# EAGLE design Qwiic Featherwing (EAGLE 8.5.0)
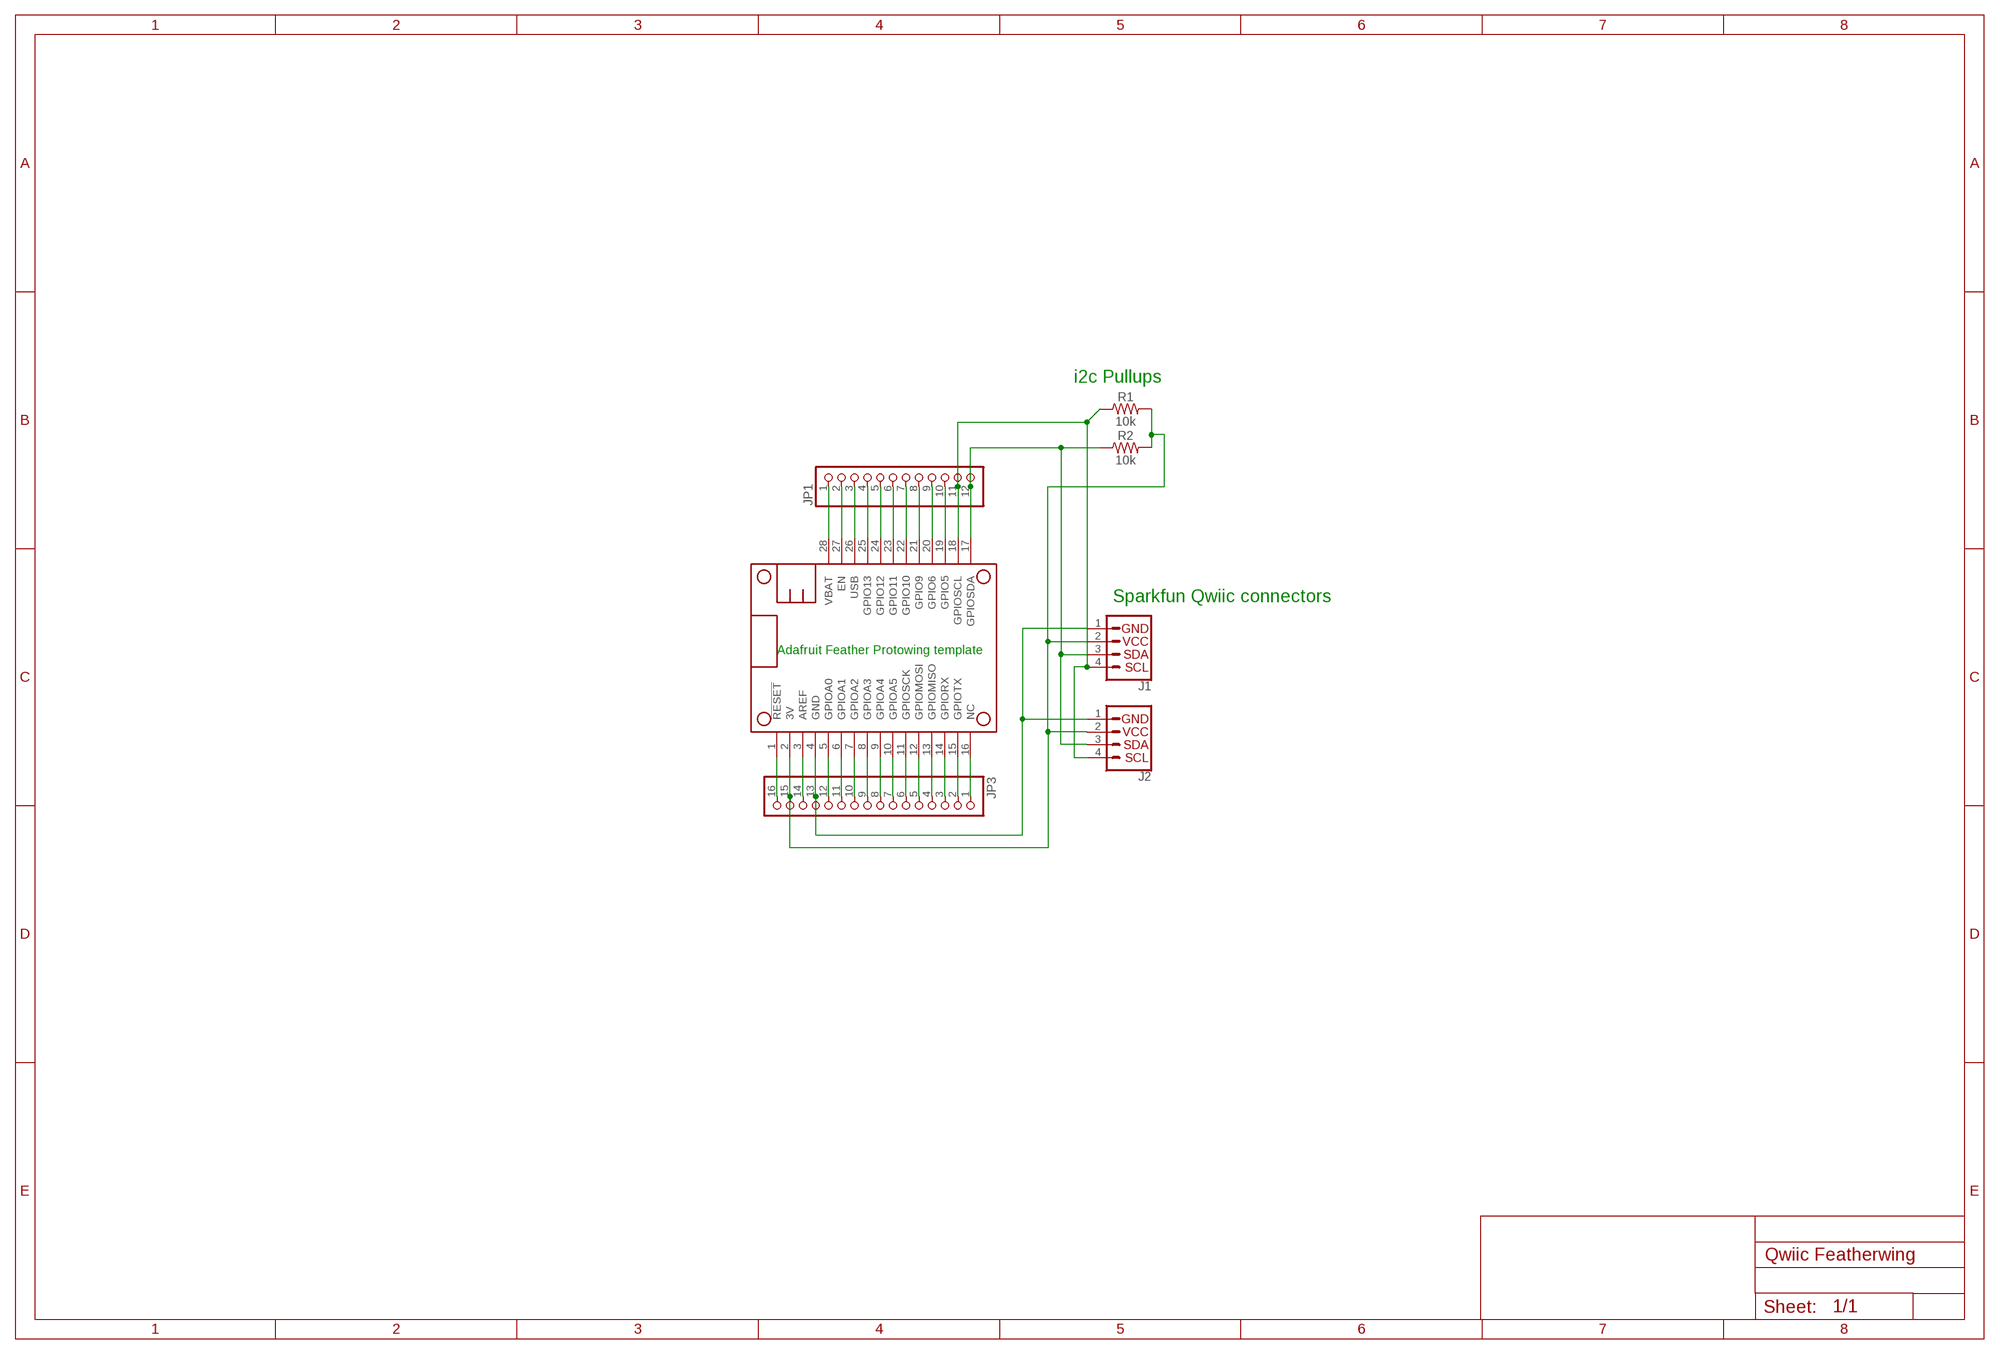
[diagram p0: schematic, sheet 1]

## Parts
J1  QWIIC_CONNECTORJS-1MM  [1X04_1MM_RA]
J2  QWIIC_CONNECTORJS-1MM  [1X04_1MM_RA]
JP1  HEADER-1X1276MIL  [1X12_ROUND_76MIL]
JP3  HEADER-1X16_76MIL  [1X16_ROUND_76MIL]
MS1  FEATHERWING  [FEATHERWING]
R1  10k  10KOHM-0603-1/10W-1%  [0603]
R2  10k  10KOHM-0603-1/10W-1%  [0603]

## Nets
3V: J1.2(VCC) J2.2(VCC) JP3.15 MS1.2(3V) R1.2 R2.2
AREF: JP3.14 MS1.3(AREF)
GND: J1.1(GND) J2.1(GND) JP3.13 MS1.4(GND)
N$1: JP1.2 MS1.27(EN)
N$2: JP3.1 MS1.16(NC)
N$3: JP1.4 MS1.25(GPIO13)
N$4: JP3.2 MS1.15(GPIOTX)
N$5: JP1.5 MS1.24(GPIO12)
N$6: JP3.3 MS1.14(GPIORX)
N$7: JP3.4 MS1.13(GPIOMISO)
N$8: JP3.5 MS1.12(GPIOMOSI)
N$9: JP3.6 MS1.11(GPIOSCK)
N$10: JP3.7 MS1.10(GPIOA5)
N$11: JP3.8 MS1.9(GPIOA4)
N$12: JP3.9 MS1.8(GPIOA3)
N$13: JP3.10 MS1.7(GPIOA2)
N$14: JP3.11 MS1.6(GPIOA1)
N$15: JP3.12 MS1.5(GPIOA0)
N$18: JP3.16 MS1.1(!RESET)
N$19: JP1.6 MS1.23(GPIO11)
N$20: JP1.7 MS1.22(GPIO10)
N$21: JP1.8 MS1.21(GPIO9)
N$22: JP1.9 MS1.20(GPIO6)
N$23: JP1.10 MS1.19(GPIO5)
N$24: J1.4(SCL) J2.4(SCL) JP1.11 MS1.18(GPIOSCL) R1.1
N$25: J1.3(SDA) J2.3(SDA) JP1.12 MS1.17(GPIOSDA) R2.1
USB: JP1.3 MS1.26(USB)
VBAT: JP1.1 MS1.28(VBAT)

## Notes on the sheet
- i2c Pullups
- Sparkfun Qwiic connectors
- Adafruit Feather Protowing template

## Library data of the parts
J1 J2 = SparkFun-Connectors:QWIIC_CONNECTOR: SparkFun I2C Standard Qwiic Connector An SMD 1mm pitch JST connector makes it easy and quick (get it? Qwiic?) to connect I2C devices to each other. The Qwiic system <http://www.sparkfun.com/qwiic> enables fast and solderless connection between popular platforms and various sensors and actuators. We carry 200mm <https://www.sparkfun.com/products/14204>, 100mm <https://www.sparkfun.com/products/14205>, 50mm <https://www.sparkfun.com/products/14206>, and breadboard friendly <https://www.sparkfun.com/products/14207> Qwiic cables. We also offer 10 pcs strips <https://www.sparkfun.com/products/14323> the SMD connectors.
JP1 = microbuilder:HEADER-1X12
JP3 = microbuilder:HEADER-1X16: PIN HEADER
MS1 = microbuilder:FEATHERWING
R1 R2 = SparkFun-Resistors:10KOHM: 10kΩ resistor A resistor is a passive two-terminal electrical component that implements electrical resistance as a circuit element. Resistors act to reduce current flow, and, at the same time, act to lower voltage levels within circuits. - Wikipedia; PROD_ID: RES-00824

## Board
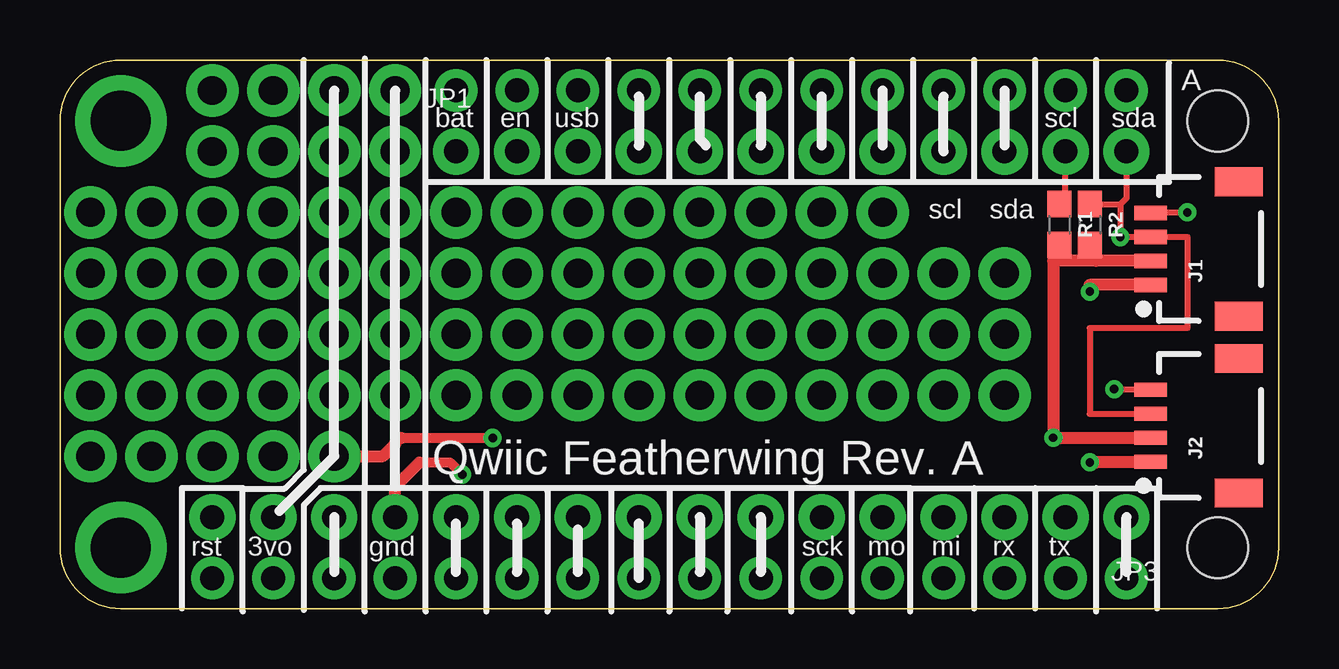
[diagram p1: board, top side]
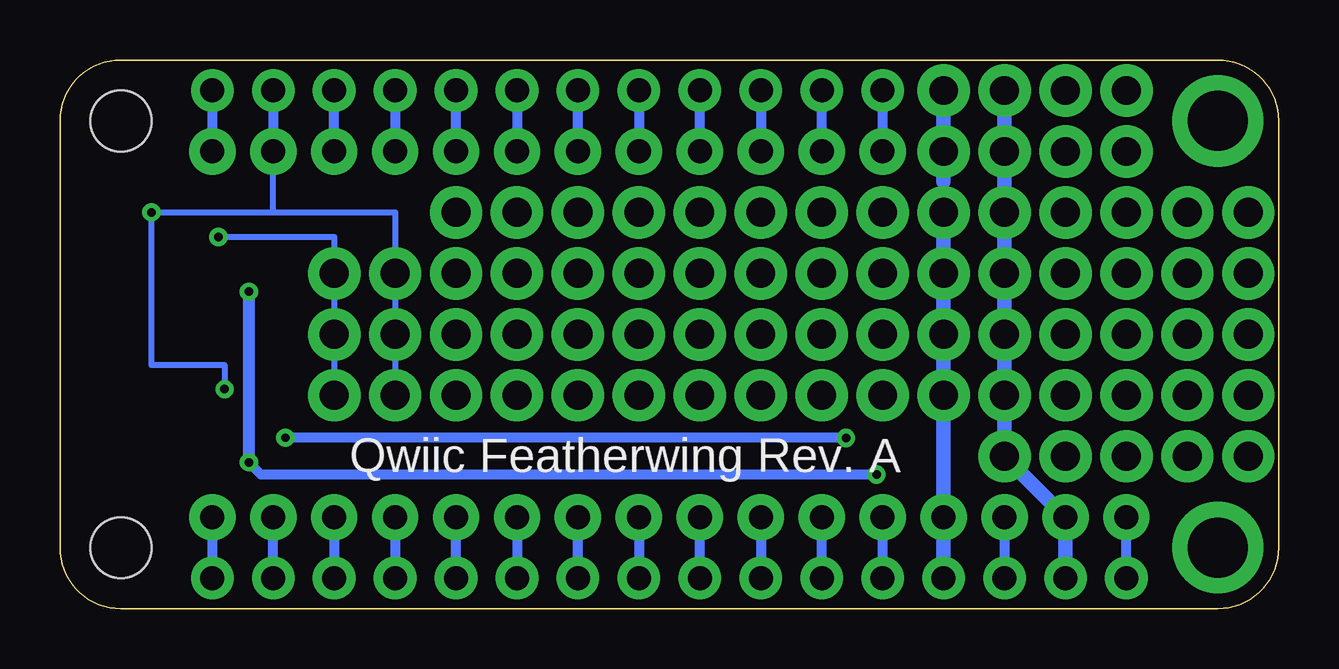
[diagram p2: board, bottom side, seen from below]

Size 50.8 x 22.86 mm. Coordinates in mm from the lower left corner, seen from the top.
Outline: 2.54,22.86 48.26,22.86 arc-90 50.8,20.32 50.8,2.54 arc-90 48.26,0 2.54,0 arc-90 0,2.54 0,20.32 arc-90 2.54,22.86
Copper layers (1*16): Top 0.035mm / dielectric 1.5mm / Bottom 0.035mm
Design rules "adafruit": minimum track width 8mil, minimum drill 15.5mil, track to track 8mil, track to pad 8mil, pad to pad 8mil, via to via 8mil, smd to smd 8mil, copper to edge 10mil, drill to drill 8mil, minimum pad ring 10mil, minimum via ring 8mil, stop-mask expansion 2mil, vias tented up to drill 20mil, thermal gap 10mil

### Footprints (pad centres in the part's own frame; a part is rotated, then mirrored left to right if it is on the bottom)
1X04_1MM_RA = smd 0.6 x 1.35: 1 -1.5,0; 2 -0.5,0; 3 0.5,0; 4 1.5,0 | smd 1.2 x 2: NC1 2.8,-3.675; NC2 -2.8,-3.675
1X12_ROUND_76MIL = drill 1 pad 1.93: 1 -13.97,0; 2 -11.43,0; 3 -8.89,0; 4 -6.35,0; 5 -3.81,0; 6 -1.27,0; 7 1.27,0; 8 3.81,0; 9 6.35,0; 10 8.89,0; 11 11.43,0; 12 13.97,0
1X16_ROUND_76MIL = drill 1 pad 1.93: 1 -19.05,0; 2 -16.51,0; 3 -13.97,0; 4 -11.43,0; 5 -8.89,0; 6 -6.35,0; 7 -3.81,0; 8 -1.27,0; 9 1.27,0; 10 3.81,0; 11 6.35,0; 12 8.89,0; 13 11.43,0; 14 13.97,0; 15 16.51,0; 16 19.05,0
FEATHERWING = drill 1 pad 1.778: 1 6.35,1.27; 2 8.89,1.27; 3 11.43,1.27; 4 13.97,1.27; 5 16.51,1.27; 6 19.05,1.27; 7 21.59,1.27; 8 24.13,1.27; 9 26.67,1.27; 10 29.21,1.27; 11 31.75,1.27; 12 34.29,1.27; 13 36.83,1.27; 14 39.37,1.27; 15 41.91,1.27; 16 44.45,1.27; 17 44.45,21.59; 18 41.91,21.59; 19 39.37,21.59; 20 36.83,21.59; 21 34.29,21.59; 22 31.75,21.59; 23 29.21,21.59; 24 26.67,21.59; 25 24.13,21.59; 26 21.59,21.59; 27 19.05,21.59; 28 16.51,21.59 | drill 2.5 pad 3.81: P$1 2.54,20.32; P$2 2.54,2.54 | hole 2.54: 48.26,20.32; 48.26,2.54
0603 = smd 1.1 x 1: 1 -0.85,0; 2 0.85,0

### Placement (x,y rotation side)
J1  45.47,14.99 90 top
J2  45.47,7.62 90 top
JP1  30.48,19.05 0 top
JP3  25.4,3.81 180 top
MS1  0,0 0 top
R1  41.66,16 270 top
R2  42.93,16 270 top

### Tracks (layer width: path | path; a pad name or v marks a point on that pad's centre or on a via)
3V  (via drill 0.35, 1.2 pad 2.18)
  Top 0.254: R2.2 43.18,14.9 43.18,14.49 | R1.2 41.66,14.74 41.4,14.49
  Top 0.406: 14.23,7.12 v18.03,7.12 v18.03,7.11
  Top 0.508: v11.43,6.35 13.46,6.35 13.97,6.86 arc-90 14.23,7.12 | J2.2 v41.4,7.12 41.4,14.49 43.18,14.49 J1.2
  Bottom 0.406: v18.03,7.11 v41.39,7.11 v41.4,7.12
  Bottom 0.61: MS1.2 JP3.15 v11.43,6.35 v11.43,8.89 v11.43,11.43 v11.43,13.97 v11.43,16.51 v11.43,19.05 v11.43,21.59
AREF
  Bottom 0.406: JP3.14 MS1.3
GND  (via drill 0.35, 1.2 pad 2.18)
  Top 0.254: 43.18,6.1 v42.93,6.1
  Top 0.406: 14.99,6.1 16.26,6.1 v16.76,5.59
  Top 0.508: JP3.13 13.97,5.08 14.99,6.1 | 43.18,6.1 45.44,6.1 J2.1 | J1.1 42.93,13.49 v42.93,13.21
  Bottom 0.406: v13.97,16.51 13.97,17.78 | v16.76,5.59 42.42,5.59 v42.93,6.1
  Bottom 0.508: v42.93,13.21 v42.93,6.1
  Bottom 0.61: MS1.4 JP3.13 v13.97,8.89 v13.97,11.43 v13.97,13.97 v13.97,16.51 | v13.97,21.59 v13.97,19.05 13.97,17.78
N$1
  Bottom 0.406: JP1.2 MS1.27
N$2
  Bottom 0.406: JP3.1 MS1.16
N$3
  Bottom 0.406: JP1.4 MS1.25
N$4
  Bottom 0.406: MS1.15 JP3.2
N$5
  Bottom 0.406: MS1.24 JP1.5
N$6
  Bottom 0.406: JP3.3 MS1.14
N$7
  Bottom 0.406: JP3.4 MS1.13
N$8
  Bottom 0.406: MS1.12 JP3.5
N$9
  Bottom 0.406: JP3.6 MS1.11
N$10
  Bottom 0.406: MS1.10 JP3.7
N$11
  Bottom 0.406: JP3.8 MS1.9
N$12
  Bottom 0.406: MS1.8 JP3.9
N$13
  Bottom 0.406: JP3.10 MS1.7
N$14
  Bottom 0.406: MS1.6 JP3.11
N$15
  Bottom 0.406: JP3.12 MS1.5
N$16  (via drill 1.2 pad 2.18)
  other vias: 1.27,16.51
N$17  (via drill 1.2 pad 2.18)
  other vias: 1.27,13.97
N$18
  Bottom 0.406: MS1.1 JP3.16
N$19
  Bottom 0.406: JP1.6 MS1.23
N$20
  Bottom 0.406: MS1.22 JP1.7
N$21
  Bottom 0.406: JP1.8 MS1.21
N$22
  Bottom 0.406: MS1.20 JP1.9
N$23
  Bottom 0.406: JP1.10 MS1.19
N$24  (via drill 0.35, 1.2 pad 2.18)
  Top 0.254: v46.99,16.51 46.99,16.49 J1.4 | 45.47,9.14 J2.4 45.44,9.14 v43.94,9.14 | R1.1 41.91,17.11 JP1.11
  Bottom 0.254: v43.94,9.14 43.94,10.16 46.99,10.16 v46.99,16.51 41.91,16.51 | 41.91,16.51 JP1.11 | 41.91,16.51 36.83,16.51 v36.83,13.97 v36.83,11.43 v36.83,8.89
  Bottom 0.406: MS1.18 JP1.11
N$25  (via drill 0.35, 1.2 pad 2.18)
  Top 0.254: J2.3 42.93,8.12 42.93,11.68 46.99,11.68 46.99,15.49 J1.3 arc90 J1.3 v44.2,15.49 44.2,16.85 | R2.1 44.2,16.85 | JP1.12 44.45,17.11 44.2,16.85
  Bottom 0.254: v44.2,15.49 39.38,15.49 39.37,15.49 v39.37,13.97 v39.37,11.43 v39.37,8.89
  Bottom 0.406: MS1.17 JP1.12
N$26  (via drill 1.2 pad 2.18)
  other vias: 1.27,11.43
N$27  (via drill 1.2 pad 2.18)
  other vias: 1.27,8.89
N$28  (via drill 1.2 pad 2.18)
  other vias: 1.27,6.35
N$29  (via drill 1.2 pad 2.18)
  other vias: 3.81,6.35
N$30  (via drill 1.2 pad 2.18)
  other vias: 8.89,21.59
N$31  (via drill 1.2 pad 2.18)
  other vias: 8.89,19.05
N$32  (via drill 1.2 pad 2.18)
  other vias: 6.35,19.05
N$33  (via drill 1.2 pad 2.18)
  other vias: 6.35,21.59
N$34  (via drill 1.2 pad 2.18)
  other vias: 6.35,16.51
N$35  (via drill 1.2 pad 2.18)
  other vias: 3.81,8.89
N$36  (via drill 1.2 pad 2.18)
  other vias: 3.81,11.43
N$37  (via drill 1.2 pad 2.18)
  other vias: 3.81,13.97
N$38  (via drill 1.2 pad 2.18)
  other vias: 3.81,16.51
N$39  (via drill 1.2 pad 2.18)
  other vias: 6.35,13.97
N$40  (via drill 1.2 pad 2.18)
  other vias: 6.35,11.43
N$45  (via drill 1.2 pad 2.18)
  other vias: 6.35,8.89
N$46  (via drill 1.2 pad 2.18)
  other vias: 6.35,6.35
N$49  (via drill 1.2 pad 2.18)
  other vias: 8.89,6.35
N$50  (via drill 1.2 pad 2.18)
  other vias: 8.89,8.89
N$51  (via drill 1.2 pad 2.18)
  other vias: 8.89,11.43
N$52  (via drill 1.2 pad 2.18)
  other vias: 8.89,13.97
N$53  (via drill 1.2 pad 2.18)
  other vias: 8.89,16.51
N$64  (via drill 1.2 pad 2.18)
  other vias: 16.51,16.51
N$65  (via drill 1.2 pad 2.18)
  other vias: 19.05,16.51
N$66  (via drill 1.2 pad 2.18)
  other vias: 21.59,16.51
N$67  (via drill 1.2 pad 2.18)
  other vias: 16.51,13.97
N$68  (via drill 1.2 pad 2.18)
  other vias: 16.51,11.43
N$69  (via drill 1.2 pad 2.18)
  other vias: 16.51,8.89
N$72  (via drill 1.2 pad 2.18)
  other vias: 19.05,8.89
N$73  (via drill 1.2 pad 2.18)
  other vias: 19.05,11.43
N$74  (via drill 1.2 pad 2.18)
  other vias: 19.05,13.97
N$75  (via drill 1.2 pad 2.18)
  other vias: 21.59,13.97
N$76  (via drill 1.2 pad 2.18)
  other vias: 21.59,11.43
N$77  (via drill 1.2 pad 2.18)
  other vias: 21.59,8.89
N$80  (via drill 1.2 pad 2.18)
  other vias: 24.13,8.89
N$81  (via drill 1.2 pad 2.18)
  other vias: 24.13,16.51
N$82  (via drill 1.2 pad 2.18)
  other vias: 24.13,13.97
N$83  (via drill 1.2 pad 2.18)
  other vias: 24.13,11.43
N$85  (via drill 1.2 pad 2.18)
  other vias: 26.67,8.89
N$86  (via drill 1.2 pad 2.18)
  other vias: 26.67,11.43
N$87  (via drill 1.2 pad 2.18)
  other vias: 26.67,13.97
N$88  (via drill 1.2 pad 2.18)
  other vias: 26.67,16.51
N$89  (via drill 1.2 pad 2.18)
  other vias: 29.21,16.51
N$90  (via drill 1.2 pad 2.18)
  other vias: 29.21,13.97
N$91  (via drill 1.2 pad 2.18)
  other vias: 29.21,11.43
N$92  (via drill 1.2 pad 2.18)
  other vias: 29.21,8.89
N$95  (via drill 1.2 pad 2.18)
  other vias: 31.75,8.89
N$96  (via drill 1.2 pad 2.18)
  other vias: 31.75,11.43
N$97  (via drill 1.2 pad 2.18)
  other vias: 31.75,13.97
N$98  (via drill 1.2 pad 2.18)
  other vias: 31.75,16.51
N$99  (via drill 1.2 pad 2.18)
  other vias: 34.29,16.51
N$100  (via drill 1.2 pad 2.18)
  other vias: 34.29,13.97
N$101  (via drill 1.2 pad 2.18)
  other vias: 34.29,11.43
N$102  (via drill 1.2 pad 2.18)
  other vias: 34.29,8.89
USB
  Bottom 0.406: MS1.26 JP1.3
VBAT
  Bottom 0.406: MS1.28 JP1.1

### Text on the board
tPlace: A | bat | en | usb | scl | sda | scl | sda | Qwiic Featherwing Rev. A | rst | 3vo | gnd | sck | mo | mi | rx | tx
bPlace: Qwiic Featherwing Rev. A